# EAGLE board esp32-nbiot-xx-v12-wroom32 (EAGLE 7.3.0), part 1 of 2
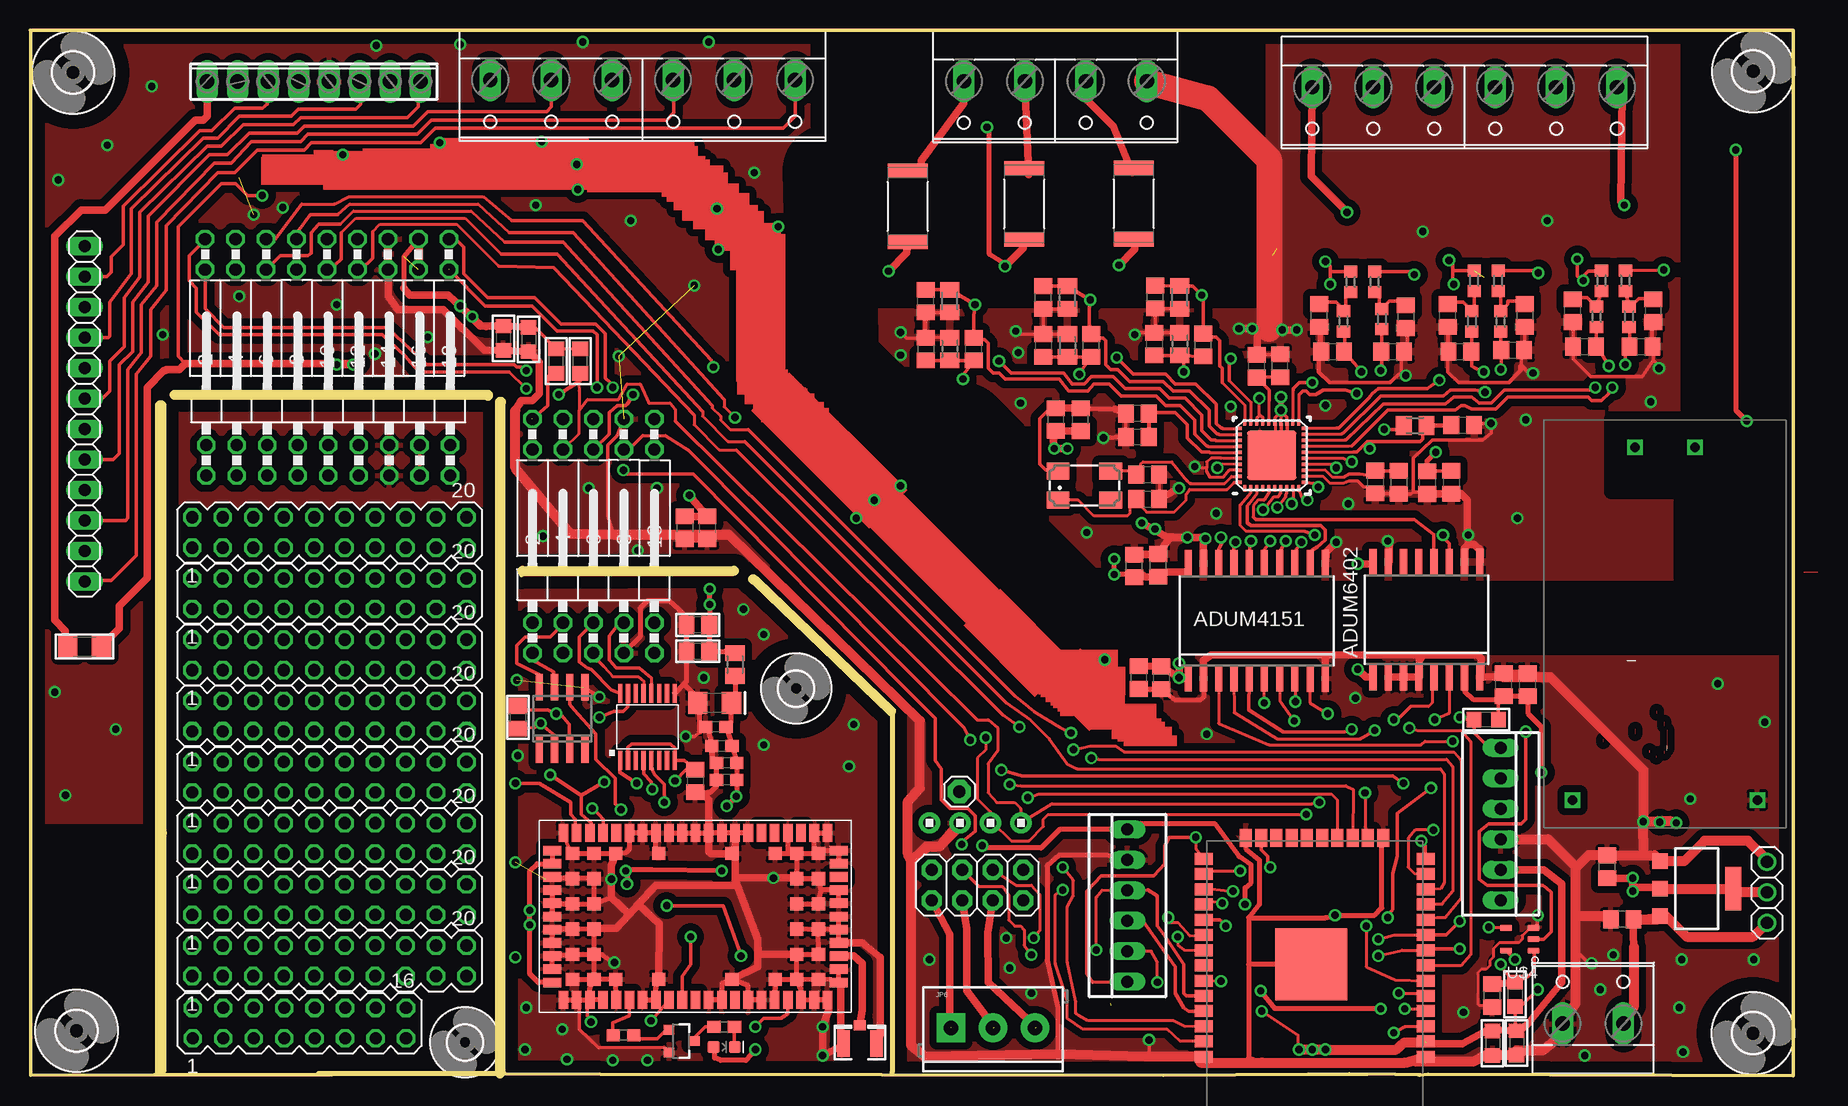
[diagram p3: board, top side]
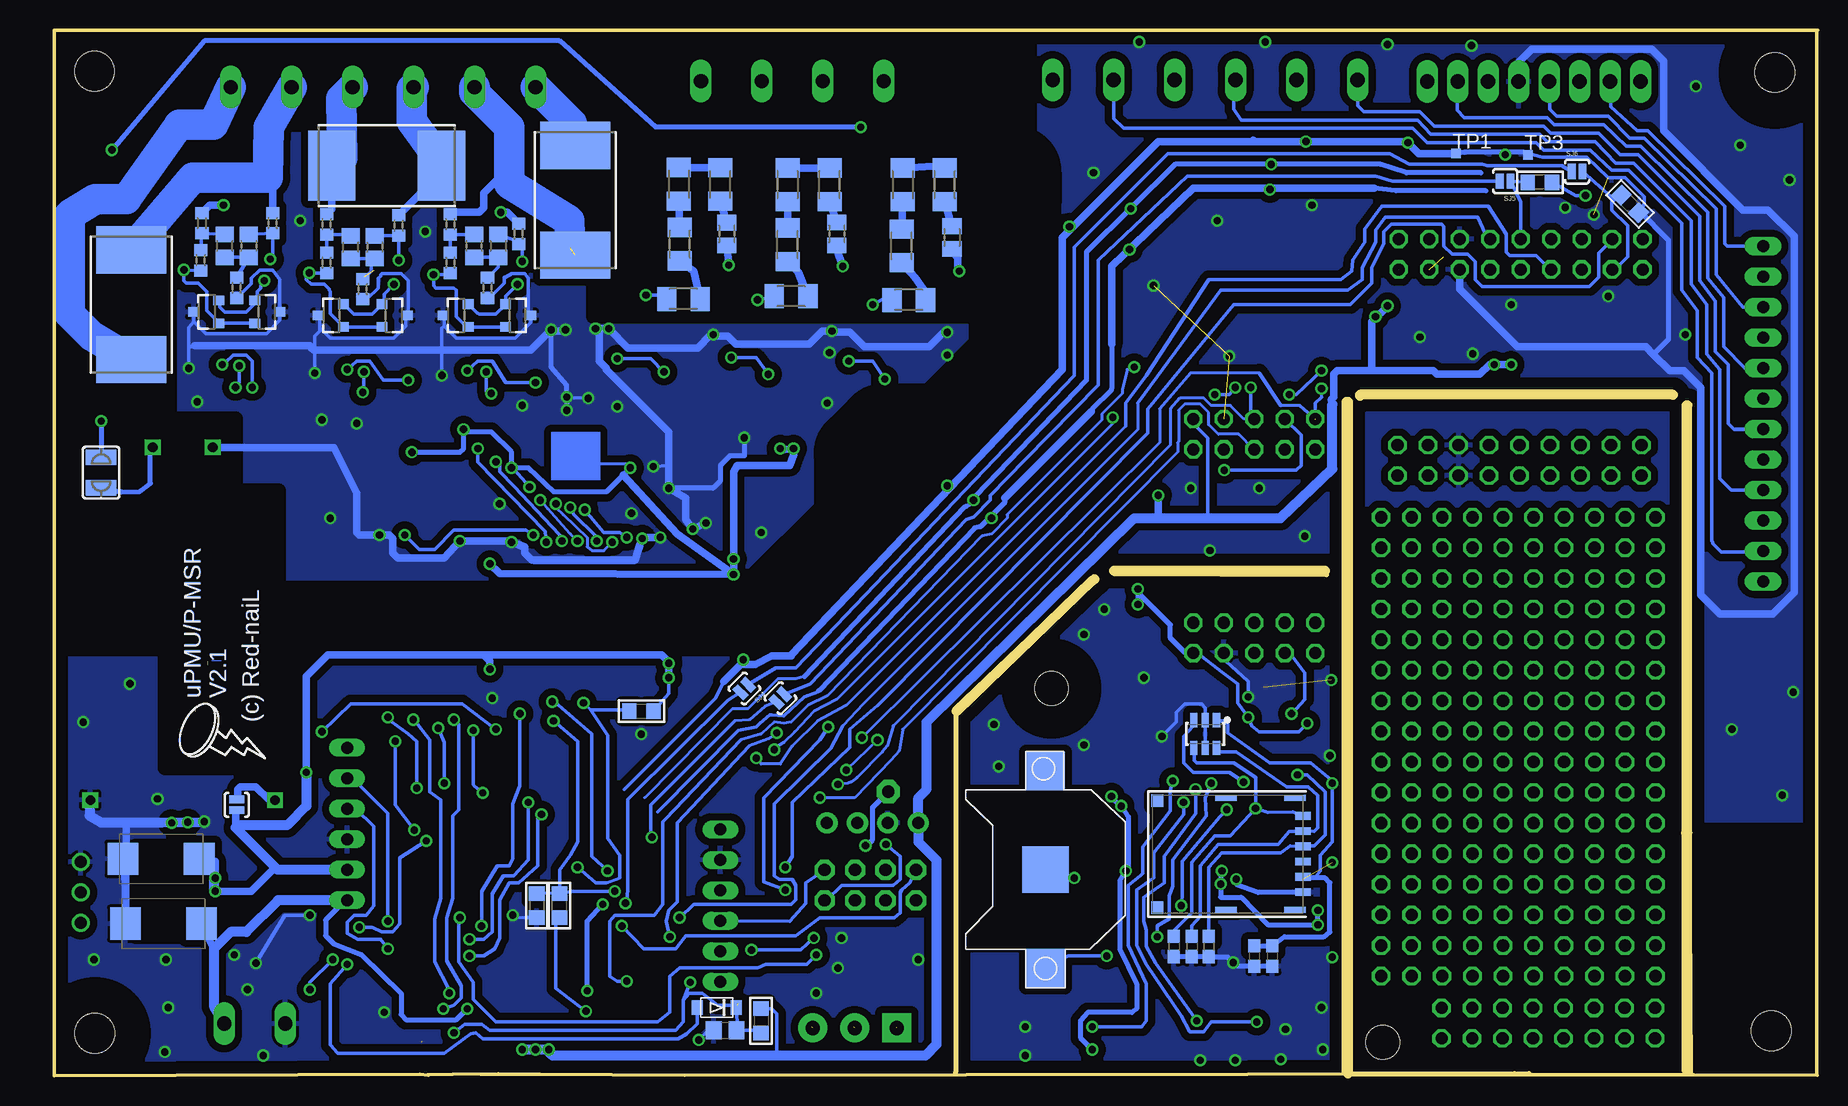
[diagram p4: board, bottom side, seen from below]

Size 146.95 x 87.2 mm. Coordinates in mm from the lower left corner, seen from the top.
Outline: 0.05,0.07 10.45,0.1
Outline: 10.45,0.1 10.35,0.1
Outline: 10.45,0.1 10.55,0.1
Outline: 10.55,0.1 10.65,20.3
Outline: 10.65,20.3 11.25,20.3 11.25,20.2
Outline: 111.42,0.12 109.9,0.12 106.5,0.15 94.42,0.07 24.05,0.2 25.25,0.2
Outline: 109.95,0.17 113.75,0.15 115.7,0.1 115.85,0.1 115.8,0.05 116.5,0.15 146.95,0 146.95,87.17 0,87.17 0.07,87.2 0.07,0.1
Outline: 12.05,56.9 12.05,56.8
Outline: 12.05,56.8 12.05,56.7
Outline: 12.05,56.7 38.15,56.7 38.15,56.8 12.05,56.8
Outline: 39.05,56.1 39.05,0.2 25.25,0.2
Outline: 71.55,30.4 60.25,41.4 60.45,41.3 71.75,30.4
Outline: 39.45,0.3 39.45,56.1
Outline: 10.65,0.4 10.65,20.3
Outline: 10.65,20.3 10.65,56
Outline: 12.05,57 37.45,57
Outline: 37.45,57 38.15,57
Outline: 12.05,56.7 37.45,57
Outline: 60.35,41.6 71.95,30.5
Outline: 71.85,30.3 71.85,0.3
Outline: 58.65,41.9 40.95,41.8
Outline: 40.95,42.3 58.45,42.3 58.65,42.2
Outline: 39.25,56.2 39.15,56.2 39.15,0.2
Outline: 10.85,55.9 10.95,55.9 10.95,0.5
Outline: 41.05,42.1 58.65,42.1
Outline: 10.55,0.1 25.15,0.1 25.25,0.2
Copper layers (1*16): Top 0.035mm / dielectric 1.5mm / Bottom 0.035mm
Design rules "default *": minimum track width 5mil, minimum drill 24mil, track to track 5mil, track to pad 8mil, pad to pad 8mil, via to via 8mil, smd to smd 8mil, copper to edge 40mil, drill to drill 8mil, minimum pad ring 10mil, minimum via ring 8mil, stop-mask expansion 4mil, vias tented up to drill 0mil, thermal gap 10mil
tKeepout: area 89.2,35.7 to 144.5,40.3; area 143.4,35.7 to 146.9,40.2; area 65.7,77.1 to 70.5,87.1; area 69.2,78.4 to 72.4,87.3; area 68.5,76.5 to 70.5,78.6; 10 lines
bKeepout: area 89.4,35.8 to 146.9,40.3; area 65.7,77.2 to 70.4,87.1; area 68.7,76.3 to 70.4,78.6; area 69.2,78.2 to 72.4,87.3; area 128.4,25.8 to 137.6,48.8; 8 lines
tRestrict: area 87.7,35.7 to 146.8,40.7; area 137.6,40 to 146.4,49.2; area 138.1,54.1 to 146.8,87; area 69.7,64.6 to 102.4,87.4; area 65.7,77.2 to 70.4,87; area 68.5,76.4 to 70.5,78.7; area 69.2,78.5 to 72.2,87.2; area 131.8,48.7 to 146.9,54.8; area 0.3,0.3 to 10.6,20.4; area 99,-0.8 to 115.2,19; 11 lines
bRestrict: area 128.2,25.7 to 137.8,48.8; area 88.3,35.6 to 146.6,40.7; area 138.8,35.8 to 146.9,40.6; area 137.5,40 to 147,49.2; area 96.2,79.3 to 146.8,87.4; area 135.3,74.4 to 146.8,87; area 69.7,63.3 to 102,87.3; area 65.7,77.3 to 70.4,87.2; area 68.5,76.4 to 70.5,78.7; area 69.2,78.3 to 72.2,87; area 131.9,48 to 147.1,54.8; area 138.1,54.7 to 146.6,75.8; area 137.3,54.7 to 146.8,75.6; area 0.1,0 to 10.3,20.5; area 58.9,10.9 to 71,23.7; area 43.1,13.7 to 55.1,23.2; area 135.9,11.6 to 140.1,19.2; 6 lines

## Footprints (pad centres in the part's own frame; a part is rotated, then mirrored left to right if it is on the bottom)
R4527 = smd 3.94 x 5.84: 1 -4.575,0; 2 4.575,0
LFCSP40 = smd 0.55 x 0.3: 1 -2.75,2.25; 2 -2.75,1.75; 3 -2.75,1.25; 4 -2.75,0.75; 5 -2.75,0.25; 6 -2.75,-0.25; 7 -2.75,-0.75; 8 -2.75,-1.25; 9 -2.75,-1.75; 10 -2.75,-2.25; 21 2.75,-2.25; 22 2.75,-1.75; 23 2.75,-1.25; 24 2.75,-0.75; 25 2.75,-0.25; 26 2.75,0.25; 27 2.75,0.75; 28 2.75,1.25; 29 2.75,1.75; 30 2.75,2.25 | smd 0.3 x 0.55: 11 -2.25,-2.75; 12 -1.75,-2.75; 13 -1.25,-2.75; 14 -0.75,-2.75; 15 -0.25,-2.75; 16 0.25,-2.75; 17 0.75,-2.75; 18 1.25,-2.75; 19 1.75,-2.75; 20 2.25,-2.75; 31 2.25,2.75; 32 1.75,2.75; 33 1.25,2.75; 34 0.75,2.75; 35 0.25,2.75; 36 -0.25,2.75; 37 -0.75,2.75; 38 -1.25,2.75; 39 -1.75,2.75; 40 -2.25,2.75 | smd 4.1 x 4.1: GND 0,0
SOIC20R = smd 0.6 x 2.2: 1 -5.715,-4.775; 2 -4.445,-4.775; 3 -3.175,-4.775; 4 -1.905,-4.775; 5 -0.635,-4.775; 6 0.635,-4.775; 7 1.905,-4.775; 8 3.175,-4.775; 9 4.445,-4.8; 10 5.715,-4.8; 11 5.715,4.8; 12 4.445,4.8; 13 3.175,4.8; 14 1.905,4.8; 15 0.635,4.8; 16 -0.635,4.8; 17 -1.905,4.8; 18 -3.175,4.8; 19 -4.445,4.8; 20 -5.715,4.8
SOIC16R = smd 0.6 x 2.2: 1 -4.445,-4.775; 2 -3.175,-4.775; 3 -1.905,-4.775; 4 -0.635,-4.775; 5 0.635,-4.775; 6 1.905,-4.775; 7 3.175,-4.775; 8 4.445,-4.775; 9 4.445,4.8; 10 3.175,4.8; 11 1.905,4.8; 12 0.635,4.8; 13 -0.635,4.8; 14 -1.905,4.8; 15 -3.175,4.8; 16 -4.445,4.8
C0805 = smd 1.3 x 1.5: 1 -0.95,0; 2 0.95,0
_0805 = smd 1.2 x 1.3: 1 -1.016,0; 2 1.016,0
0805 = smd 1.3 x 1.5: 1 -0.95,0; 2 0.95,0
0603 = smd 1.1 x 1: 1 -0.85,0; 2 0.85,0
1206-POLAR = smd 1.6 x 1.8: 1 -1.4,0; 2 1.4,0
D/7343-31R = smd 2.55 x 2.7: + 3.175,0; - -3.175,0
SOD-123FL = smd 0.91 x 1.22: A 1.637,0; C -1.637,0
LED-0603 = smd 1 x 1: A -0.877,0; C 0.877,0
SOT23-6L = smd 0.6 x 1.2: 1 -0.95,-1.15; 2 0,-1.15; 3 0.95,-1.15; 4 0.95,1.15; 5 0,1.15; 6 -0.95,1.15
RESC6332X71N = smd 1.194 x 3.353: 1 -2.972,0; 2 2.972,0
3,3 = hole 3.3: 0,0
1X4 = drill 1.016 pad 1.778: 1 0,0; 2 2.54,0; 3 5.08,0; 4 7.62,0
HKLPM01 = drill 0.8 square: P$1 -14.7,2.5; P$2 -14.7,-2.5; P$3 14.7,7.7; P$4 14.7,-7.7
NANO_SIM_WURTH_693043020611 = smd 0.65 x 1.3: C1 1.905,6.25; C2 -0.635,6.25; C3 -1.905,6.25; C5 3.175,6.25; C6 0.635,6.25; C7 -3.175,6.25 | smd 0.48 x 1.8: MNT1 -4.69,5.58; MNT2 4.66,5.58; MNT3 -4.69,-0.17; MNT4 4.66,-0.17 | smd 1.03 x 1: MNT5 -4.465,-5.89; MNT6 4.465,-5.89
2X04 = drill 1.016 pad 1.676 octagon: 1 -3.81,-1.27; 2 -3.81,1.27; 3 -1.27,-1.27; 4 -1.27,1.27; 5 1.27,-1.27; 6 1.27,1.27; 7 3.81,-1.27; 8 3.81,1.27
2X05/90 = drill 1.016 octagon: 1 -5.08,-6.35; 2 -5.08,-3.81; 3 -2.54,-6.35; 4 -2.54,-3.81; 5 0,-6.35; 6 0,-3.81; 7 2.54,-6.35; 8 2.54,-3.81; 9 5.08,-6.35; 10 5.08,-3.81
2X09/90 = drill 1.016 octagon: 1 -10.16,-6.35; 2 -10.16,-3.81; 3 -7.62,-6.35; 4 -7.62,-3.81; 5 -5.08,-6.35; 6 -5.08,-3.81; 7 -2.54,-6.35; 8 -2.54,-3.81; 9 0,-6.35; 10 0,-3.81; 11 2.54,-6.35; 12 2.54,-3.81; 13 5.08,-6.35; 14 5.08,-3.81; 15 7.62,-6.35; 16 7.62,-3.81; 17 10.16,-6.35; 18 10.16,-3.81
1X12 = drill 1.016 long: 1 -13.97,0; 2 -11.43,0; 3 -8.89,0; 4 -6.35,0; 5 -3.81,0; 6 -1.27,0; 7 1.27,0; 8 3.81,0; 9 6.35,0; 10 8.89,0; 11 11.43,0; 12 13.97,0
1X03 = drill 1.016: 1 -2.54,0; 2 0,0; 3 2.54,0
SCREWTERMINAL-3.5MM-3 = drill 1.2 pad 2.413 square: 1 0,0 | drill 1.2 pad 2.413: 2 3.5,0; 3 7,0
1X01 = drill 1.016 pad 1.93 octagon: 1 0,0
M0805 = smd 1.3 x 1.6: 1 -0.95,0; 2 0.95,0
1206 = smd 1.6 x 1.8: 1 -1.4,0; 2 1.4,0
CTS406 = smd 1.9 x 1.4: 1 -2.2,-1.2; 2 2.2,-1.2; 3 2.2,1.2; 4 -2.2,1.2
SOT23-3 = smd 0.8 x 0.9: 1 -0.95,-1; 2 0.95,-1; 3 0,1.1
M1206 = smd 1.6 x 2: 1 -1.4,0; 2 1.4,0
R0805 = smd 1.3 x 1.5: 1 -0.95,0; 2 0.95,0
R0603 = smd 1 x 1.1: 1 -0.85,0; 2 0.85,0
SJ_2S-NO = smd 0.635 x 1.27: 1 -0.45,0; 2 0.45,0
SOLDERJUMPER_WAVE = smd 1.27 x 2.54: 1 -1.27,0; 2 1.27,0
FE05-2W = drill 1.016 octagon: 1 -5.08,1.27; 2 -5.08,-1.27; 3 -2.54,1.27; 4 -2.54,-1.27; 5 0,1.27; 6 0,-1.27; 7 2.54,1.27; 8 2.54,-1.27; 9 5.08,1.27; 10 5.08,-1.27
FE09-2W = drill 1.016 octagon: 1 -10.16,1.27; 2 -10.16,-1.27; 3 -7.62,1.27; 4 -7.62,-1.27; 5 -5.08,1.27; 6 -5.08,-1.27; 7 -2.54,1.27; 8 -2.54,-1.27; 9 0,1.27; 10 0,-1.27; 11 2.54,1.27; 12 2.54,-1.27; 13 5.08,1.27; 14 5.08,-1.27; 15 7.62,1.27; 16 7.62,-1.27; 17 10.16,1.27; 18 10.16,-1.27
MA10-2 = drill 1.016 octagon: 1 -11.43,-1.27; 2 -11.43,1.27; 3 -8.89,-1.27; 4 -8.89,1.27; 5 -6.35,-1.27; 6 -6.35,1.27; 7 -3.81,-1.27; 8 -3.81,1.27; 9 -1.27,-1.27; 10 -1.27,1.27; 11 1.27,-1.27; 12 1.27,1.27; 13 3.81,-1.27; 14 3.81,1.27; 15 6.35,-1.27; 16 6.35,1.27; 17 8.89,-1.27; 18 8.89,1.27; 19 11.43,-1.27; 20 11.43,1.27
MA08-2 = drill 1.016 octagon: 1 -8.89,-1.27; 2 -8.89,1.27; 3 -6.35,-1.27; 4 -6.35,1.27; 5 -3.81,-1.27; 6 -3.81,1.27; 7 -1.27,-1.27; 8 -1.27,1.27; 9 1.27,-1.27; 10 1.27,1.27; 11 3.81,-1.27; 12 3.81,1.27; 13 6.35,-1.27; 14 6.35,1.27; 15 8.89,-1.27; 16 8.89,1.27
TP08SQ = smd 0.8 x 0.8: TP 0,0
TSSOP16 = smd 1.6 x 0.35: P$1 -2.8,2.275; P$2 -2.8,1.625; P$3 -2.8,0.975; P$4 -2.8,0.325; P$5 -2.8,-0.325; P$6 -2.8,-0.975; P$7 -2.8,-1.625; P$8 -2.8,-2.275; P$9 2.8,-2.275; P$10 2.8,-1.625; P$11 2.8,-0.975; P$12 2.8,-0.325; P$13 2.8,0.325; P$14 2.8,0.975; P$15 2.8,1.625; P$16 2.8,2.275
SOT223-R = smd 1.3 x 1.3: 1 -2.3,-3.05; 2 0,-3.05; 3 2.3,-3.05 | smd 3.6 x 1.3: 4 0,3.05
ESP-WROOM-32 = smd 1.5 x 1: 1 -9.25,7; 2 -9.25,5.73; 3 -9.25,4.46; 4 -9.25,3.19; 5 -9.25,1.92; 6 -9.25,0.65; 7 -9.25,-0.62; 8 -9.25,-1.89; 9 -9.25,-3.16; 10 -9.25,-4.43; 11 -9.25,-5.7; 12 -9.25,-6.97; 13 -9.25,-8.24; 14 -9.25,-9.51; 25 9.25,-9.51; 26 9.25,-8.24; 27 9.25,-6.97; 28 9.25,-5.7; 29 9.25,-4.43; 30 9.25,-3.16; 31 9.25,-1.89; 32 9.25,-0.62; 33 9.25,0.65; 34 9.25,1.92; 35 9.25,3.19; 36 9.25,4.46; 37 9.25,5.73; 38 9.25,7 | smd 1 x 1.5: 15 -5.7,-11.25; 16 -4.43,-11.25; 17 -3.16,-11.25; 18 -1.89,-11.25; 19 -0.62,-11.25; 20 0.65,-11.25; 21 1.92,-11.25; 22 3.19,-11.25; 23 4.46,-11.25; 24 5.73,-11.25 | smd 6 x 6: GND 0.3,-0.7
SOIC8 = smd 0.6 x 2.2: 32KHZ -1.905,-2.6; !INT/!!SQW 0.635,-2.6; !RST 1.905,-2.6; GND 1.905,2.6; SCL -1.905,2.6; SDA -0.635,2.6; VBAT 0.635,2.6; VCC -0.635,-2.6
CR1220-SMD = smd 3.2 x 3.2: +$1 -8.2,0; +$2 8.2,0 | smd 3.9 x 3.9: - 0,0
SOT-23-5L = smd 0.5 x 1: 1 -0.95,-1.15; 2 0,-1.15; 3 0.95,-1.15; 4 0.95,1.15; 5 -0.95,1.15
SARA-N2 = smd 1.5 x 0.8: P$1 1.05,2; P$2 1.05,3.1; P$3 1.05,4.2; P$4 1.05,5.3; P$5 1.05,6.4; P$6 1.05,7.5; P$7 1.05,8.6; P$8 1.05,9.7; P$9 1.05,10.8; P$10 1.05,11.9; P$11 1.05,13; P$12 1.05,14.1; P$13 1.05,15.2; P$14 1.05,16.3; P$15 1.05,17.4; P$16 1.05,18.5; P$17 1.05,19.6; P$18 1.05,20.7; P$19 1.05,21.8; P$20 1.05,22.9; P$21 1.05,24; P$22 14.95,2; P$23 14.95,3.1; P$24 14.95,4.2; P$25 14.95,5.3; P$26 14.95,6.4; P$27 14.95,7.5; P$28 14.95,8.6; P$29 14.95,9.7; P$30 14.95,10.8; P$31 14.95,11.9; P$32 14.95,13; P$33 14.95,14.1; P$34 14.95,15.2; P$35 14.95,16.3; P$36 14.95,17.4; P$37 14.95,18.5; P$38 14.95,19.6; P$39 14.95,20.7; P$40 14.95,21.8; P$41 14.95,22.9; P$42 14.95,24 | smd 0.8 x 1.5: P$43 3.6,24.95; P$44 4.7,24.95; P$45 5.8,24.95; P$46 6.9,24.95; P$47 8,24.95; P$48 9.1,24.95; P$49 10.2,24.95; P$50 11.3,24.95; P$51 12.4,24.95; P$52 13.5,24.95; P$53 2.5,24.95; P$54 2.5,1.05; P$55 3.6,1.05; P$56 4.7,1.05; P$57 5.8,1.05; P$58 6.9,1.05; P$59 8,1.05; P$60 9.1,1.05; P$61 10.2,1.05; P$62 11.3,1.05; P$63 12.4,1.05; P$64 13.5,1.05 | smd 1.1 x 1.1: P$65 2.75,23.25; P$66 4.85,23.25; P$67 6.95,23.25; P$68 9.05,23.25; P$69 11.15,23.25; P$70 13.25,23.25; P$71 2.75,21.45; P$72 4.85,21.45; P$73 6.95,21.45; P$74 9.05,21.45; P$75 11.15,21.45; P$76 13.25,21.45; P$77 2.75,19.65; P$78 13.25,19.65; P$79 2.75,16.05; P$80 13.25,16.05; P$81 13.25,2.75; P$82 11.15,2.75; P$83 9.05,2.75; P$84 6.95,2.75; P$85 4.85,2.75; P$86 2.75,2.75; P$87 13.25,4.55; P$88 11.15,4.55; P$89 9.05,4.55; P$90 6.95,4.55; P$91 4.85,4.55; P$92 2.75,4.55; P$93 13.25,6.35; P$94 2.75,6.35; P$95 13.25,9.95; P$96 2.75,9.95
2,8 = hole 2.8: 0,0
22-23-2061 = drill 1 long: 1 -6.35,0; 2 -3.81,0; 3 -1.27,0; 4 1.27,0; 5 3.81,0; 6 6.35,0
W237-4P = drill 1.194 long: 1 -7.62,-0.635; 2 -2.54,-0.635; 3 2.54,-0.635; 4 7.62,-0.635
W237-6P = drill 1.194 long: 1 -12.7,-0.635; 2 -7.62,-0.635; 3 -2.54,-0.635; 4 2.54,-0.635; 5 7.62,-0.635; 6 12.7,-0.635
U.FL = smd 2.2 x 1.05: 1 0,1.375; 2 0,-1.375 | smd 0.8 x 1: 3 1.525,0
W237-132 = drill 1.194 long: 1 -2.54,-0.635; 2 2.54,-0.635
8POL254 = drill 1.2 long: 1 -8.89,0; 2 -6.35,0; 3 -3.81,0; 4 -1.27,0; 5 1.27,0; 6 3.81,0; 7 6.35,0; 8 8.89,0

## Placement (x,y rotation side)
0.05/2W  [R4527]  103.55,73 270 bottom
0.05/2W1  [R4527]  140.55,64.3 270 bottom
0.05/2W2  [R4527]  119.25,75.9 180 bottom
ADE9000  [LFCSP40]  103.48,51.74 180 top
ADUM4151  [SOIC20R]  102.23,37.93 0 top
ADUM6402-2  ADUM6402  [SOIC16R]  116.36,38.03 0 top
C1  1uF  [C0805]  119.39,54.26 0 top
C2  0.1uF  [C0805]  114.06,49.5 270 top
C3  4.7uF  [C0805]  112.11,49.53 270 top
C4  0.1uF  [C0805]  104.17,59.2 90 top
C5  4.7uF  [C0805]  102.22,59.17 90 top
C6  0.1uF  [C0805]  92.28,55.22 180 top
C7  4.7uF  [C0805]  92.28,53.25 180 top
C8  18pF  [C0805]  93.14,48.11 0 top
C9  18pF  [C0805]  93.14,50.13 0 top
C10  0.1uF  [C0805]  85.5,54.73 90 top
C11  10uF  [C0805]  87.55,54.72 90 top
C12  22nF  [C0805]  84.45,60.9 270 top
C13  22nF  [C0805]  84.45,64.9 90 top
C14  51pF  [C0805]  88.45,60.9 90 top
C15  22nF  [C0805]  74.65,60.6 270 top
C16  22nF  [C0805]  74.65,64.6 90 top
C17  51pF  [C0805]  78.65,60.6 90 top
C18  22nF  [C0805]  129.55,60.8 0 top
C18E  100nF  [_0805]  121.89,2.71 270 top
C18E1  100nF  [_0805]  39.45,61.5 270 top
C19  22nF  [C0805]  134.25,60.8 0 top
C19E  10U  [_0805]  123.89,2.74 270 top
C19E1  10U  [_0805]  41.55,61.4 270 top
C20  22nF  [C0805]  119.15,60.4 0 top
C21  22nF  [C0805]  123.55,60.5 0 top
C22  22nF  [C0805]  108.55,60.4 0 top
C23  22nF  [C0805]  113.55,60.4 0 top
C24  [0805]  55.65,37.6 180 top
C25  [0805]  55.65,35.4 180 top
C26  47pF  [0603]  50.75,10.8 270 bottom
C27  47pF  [0603]  52.15,10.8 270 bottom
C28  47pF  [0603]  53.65,10.8 270 bottom
C29  47pF  [0603]  46.95,10 270 bottom
C30  0.1uF  [0603]  45.45,10 270 bottom
C30A  0.1uF  [C0805]  92.38,33.21 270 top
C30A1  68pfF  [C0805]  54.55,45.7 270 top
C31  100uF  [1206-POLAR]  57.05,31.1 180 top
C31A  10uF  [C0805]  94.28,33.19 270 top
C31A1  10pF  [C0805]  56.45,45.7 270 top
C32  0.1uF  [0603]  57.15,29.1 180 top
C32A  0.1uF  [C0805]  94.02,42.56 90 top
C33  10nF  [0603]  57.65,27.5 180 top
C33A  10uF  [C0805]  92.02,42.51 90 top
C34  15pF  [0603]  58.05,24.7 180 top
C34A  10uF  [C0805]  116.43,49.47 270 top
C35  68pF  [0603]  58.05,26.1 180 top
C35A  0.1uF  [C0805]  118.43,49.48 270 top
C36  [D/7343-31R]  137.85,12.7 0 bottom
C36A  0.1uF  [C0805]  124.82,32.61 90 top
C37  [D/7343-31R]  138.05,18.1 0 bottom
C37A  10uF  [C0805]  122.82,32.61 90 top
C40U1  10uF  [C0805]  121.85,6.7 90 top
C40U2  100n  [C0805]  91.05,3.8 0 bottom
C40U3  0.1uF  [C0805]  55.45,24.6 270 top
C44P  10uF  [C0805]  132.69,13.04 180 top
C45P  10uF  [C0805]  131.44,17.44 90 top
C100  22nF  [C0805]  93.77,64.94 90 top
C101  51pF  [C0805]  97.77,60.94 90 top
C200  22nF  [C0805]  93.68,61.01 270 top
D1  [SOD-123FL]  91.75,5.7 180 bottom
D5  BLUE  [LED-0603]  57.85,2.4 0 top
D6  DT1042-04SO-7  [SOT23-6L]  51.05,28.5 180 bottom
FUSE1  [RESC6332X71N]  82.85,72.7 90 top
FUSE2  [RESC6332X71N]  91.97,72.73 90 top
FUSE3  [RESC6332X71N]  73.15,72.5 90 top
H1  MOUNT-HOLE3.3  [3,3]  3.87,3.76 0 top
H2  MOUNT-HOLE3.3  [3,3]  143.58,3.56 0 top
H3  MOUNT-HOLE3.3  [3,3]  3.59,83.66 0 top
H4  MOUNT-HOLE3.3  [3,3]  143.6,83.76 0 top
H5  1X4  [1X4]  74.95,21.1 0 top
HKLP1  HKLPM01  [HKLPM01]  136.25,37.7 270 top
J9  NANO_SIM  [NANO_SIM_WURTH_693043020611]  49.15,18.5 270 bottom
JP1  [2X04]  78.95,15.9 180 top
JP2  [2X05/90]  46.95,41.6 0 top
JP3  [2X09/90]  24.85,56.4 0 top
JP4  [1X12]  4.55,55.2 90 top
JP5  [1X03]  144.75,15.3 90 top
JP6  [SCREWTERMINAL-3.5MM-3]  76.75,4 0 top
JP8  [1X01]  77.45,23.7 0 top
L1  1500  [M0805]  90.92,70.19 90 bottom
L2  1500  [M0805]  81.75,70.2 90 bottom
L3  1500  [M0805]  72.15,69.9 90 bottom
L4  1500  [M0805]  58.75,34.3 90 top
PTC1  [1206]  4.55,35.8 0 top
Q1  [CTS406]  87.86,49.22 0 top
Q2  MMBD4148SE  [SOT23-3]  129.25,63.7 270 bottom
Q3  MMBD4148SE  [SOT23-3]  134.25,63.7 90 bottom
Q4  MMBD4148SE  [SOT23-3]  118.65,63.4 270 bottom
Q5  MMBD4148SE  [SOT23-3]  123.85,63.4 90 bottom
Q6  MMBD4148SE  [SOT23-3]  108.35,63.4 270 bottom
Q7  MMBD4148SE  [SOT23-3]  113.45,63.4 90 bottom
Q8  600mA/40V  [SOT23-3]  54.25,2.9 270 top
R1  200k  [M1206]  94.91,74.34 90 bottom
R2  1k  [M0805]  86.45,60.9 90 top
R3  10k  [M0805]  115.42,54.22 180 top
R4  0/200k  [M1206]  94.82,69.35 270 bottom
R5  1k  [M0805]  86.45,64.9 270 top
R6  200k  [M1206]  82.35,74.3 270 bottom
R7  0/200K  [M1206]  85.55,65 0 bottom
R8  200k  [M1206]  85.85,74.3 90 bottom
R9  0/200k  [M1206]  85.85,69.3 270 bottom
R10  1k  [M0805]  76.65,60.6 90 top
R11  1k  [M0805]  76.65,64.6 270 top
R12  200k  [M1206]  72.75,74.3 270 bottom
R13  0/200K  [M1206]  75.75,64.7 0 bottom
R14  200k  [M1206]  76.25,74.3 90 bottom
R15  0/200k  [M1206]  76.35,69.2 270 bottom
R15E1  10k/nc  [_0805]  104.85,14.2 90 bottom
R15E2  10k/nc  [_0805]  106.75,14.2 270 bottom
R15E3  4k7  [_0805]  45.85,59.6 90 top
R15E4  10k  [_0805]  88.05,4.6 270 bottom
R15E6  4k7  [_0805]  43.85,59.6 90 top
R15E7  ]  [_0805]  121.35,29.7 180 top
R15E8  +  [_0805]  123.75,6.8 270 top
R15E10  4k7  [_0805]  15.65,72.7 315 bottom
R15E11  4k7  [_0805]  23.15,74.5 180 bottom
R16  5.1  [R0805]  130.75,69.2 270 bottom
R17  5.1  [R0805]  132.75,69.2 90 bottom
R18  [0805]  40.65,29.9 270 top
R19  10k  [0603]  49.45,3.4 180 top
R20  0  [R0603]  131.75,65.7 270 bottom
R20E  10K  [_0805]  98.02,30.42 0 bottom
R21  0  [R0603]  130.95,66.3 270 top
R22  0  [R0603]  132.95,66.3 90 top
R23  0  [R0603]  128.75,71.1 270 bottom
R24  0  [R0603]  134.65,71.1 270 bottom
R25  0  [R0603]  134.75,68 270 bottom
R26  5.1  [R0805]  120.25,69.1 270 bottom
R27  5.1  [R0805]  122.25,69.1 90 bottom
R28  0  [R0603]  120.35,66.3 270 top
R29  0  [R0603]  122.35,66.3 90 top
R30  1k  [R0603]  120.15,62.9 270 top
R31  1k  [R0603]  122.55,62.9 270 top
R32  1k  [0603]  57.85,4.1 0 top
R34  0  [R0603]  121.25,65.6 270 bottom
R35  1k  [R0603]  130.55,63.3 270 top
R36  1k  [R0603]  133.25,63.3 270 top
R37  0  [R0603]  118.25,70.9 270 bottom
R38  0  [R0603]  124.25,71 270 bottom
R39  0  [R0603]  124.25,67.8 270 bottom
R40  5.1  [R0805]  109.95,69.2 270 bottom
R41  5.1  [R0805]  111.95,69.2 90 bottom
R42  0  [R0603]  110.05,66.2 270 top
R43  0  [R0603]  112.05,66.2 90 top
R44  1k  [R0603]  109.45,62.9 270 top
R45  1k  [R0603]  112.65,63.1 270 top
R48  0  [R0603]  110.85,65.7 270 bottom
R49  0  [R0603]  108.25,70.2 270 bottom
R50  0  [R0603]  113.95,71 270 bottom
R51  0  [R0603]  113.95,67.8 270 bottom
R100  0/200K  [M1206]  94.52,64.78 0 bottom
R101  200k  [M1206]  91.47,74.33 270 bottom
R104  1k  [M0805]  95.81,64.91 270 top
R200  1k  [M0805]  95.82,61.02 90 top
SJ1  SOLDERJUMPERNO  [SJ_2S-NO]  131.75,22.6 90 bottom
SJ2  [SOLDERJUMPER_WAVE]  143.05,50.3 270 bottom
SJ3  SOLDERJUMPERNO  [SJ_2S-NO]  86.45,31.5 225 bottom
SJ4  SOLDERJUMPERNO  [SJ_2S-NO]  89.45,32.3 225 bottom
SJ5  SOLDERJUMPERNO  [SJ_2S-NO]  26.05,74.6 180 bottom
SJ6  SOLDERJUMPERNO  [SJ_2S-NO]  20.05,75.4 0 bottom
SP1  NC  [C0805]  128.55,63.8 90 top
SP2  NC  [C0805]  118.15,63.4 90 top
SP3  NC  [C0805]  107.45,63.4 90 top
SP@  NC  [C0805]  135.25,63.8 270 top
SP@1  NC  [C0805]  124.55,63.4 270 top
SP@2  NC  [C0805]  114.65,63.3 270 top
SV1  [FE05-2W]  46.95,53.5 0 top
SV2  [FE09-2W]  24.75,68.5 0 top
SV3  [MA10-2]  24.95,45.3 0 top
SV4  [MA10-2]  24.95,40.2 0 top
SV5  [MA10-2]  24.95,35.1 0 top
SV6  [MA10-2]  24.95,30 0 top
SV7  [MA08-2]  22.45,4.4 0 top
SV8  [MA10-2]  24.95,24.9 0 top
SV9  [MA10-2]  24.95,19.8 0 top
SV10  [MA10-2]  24.95,14.7 0 top
SV11  [MA10-2]  24.95,9.6 0 top
TP1  PTR1TP08SQ  [TP08SQ]  30.15,76.9 0 bottom
TP3  PTR1TP08SQ  [TP08SQ]  24.15,76.8 0 bottom
U1  TXB0106  [TSSOP16]  51.45,29.1 90 top
U3  [SOT223-R]  138.89,15.61 270 top
U4  ESP-WROOM-32  [ESP-WROOM-32]  107.05,8.6 180 top
U$1  DS3232M  [SOIC8]  44.35,29.8 0 top
U$3  [CR1220-SMD]  64.35,17.2 90 bottom
U$4  SN74LVC1G126DBVT  [SOT-23-5L]  124.15,11.4 90 top
U$5  U-BLOX_SARA-N2  [SARA-N2]  68.45,5.3 90 top
U$7  [2,8]  36.25,2.8 0 top
U$8  [2,8]  63.85,32.3 0 top
X1  [22-23-2061]  122.55,21 270 top
X2  [W237-4P]  85.45,82.3 180 top
X3  [W237-6P]  119.55,81.8 180 top
X4  [U.FL]  69.15,2.7 90 top
X5  [22-23-2061]  91.45,14.2 90 top
X6  [W237-132]  130.25,5 0 top
X7  [8POL254]  23.65,82.9 0 top
X8  [W237-6P]  51.05,82.4 180 top

## Tracks (layer width: path | path; a pad name or v marks a point on that pad's centre or on a via)
1V8  (via drill 0.6)
  Top 0.305: U1.P$2 49.83,27.37 50.15,27.7 53.35,27.7 53.75,27.3 53.75,26.32 U1.P$8 54.5,26.3 C40U3.1 54.7,25.55 v53.75,24.6 | v60.45,4.1 61.15,4.8 62.55,4.8 63.15,5.2 U$5.P$4
  Bottom 0.305: v53.75,24.6 53.95,23.8 53.95,22.1 56.25,19.1 56.25,16.9 56.45,16.7 57.45,15.9 57.45,10.9 55.95,7.7 55.95,4.6 56.35,4.1 v60.45,4.1
1WIRE
  Bottom 0.305: JP4.12 7.42,69.17 7.45,69.2 7.55,69.2 7.75,69.4 7.75,72.5 14.15,78.8 15.05,78.8 17.25,80.8 17.25,82.85 X7.2
+3V3  (via drill 0.6)  (2 unrouted)
  Top 0.254: R15E3.2 45.93,60.6 R15E6.2 | 111.85,32.8 111.85,33.19 ADUM6402-2.1 | 110.84,33.41 v110.65,33.9 | v102.65,5.4 105.65,3.4 105.65,2.2 106.55,2.5 v106.85,2.2
  Top 0.305: C19E.1 123.75,3.9 R15E8.2 124.23,5.78 v125.65,7.2 | 121.75,3.87 C18E.1 | v123.75,9.7 U$4.5 | R15E7.1 122.37,31.21 C37A.1 | C19E1.1 42.05,62.42 R15E6.2 | v19.35,73.4 18.15,73.4 17.15,74.4 15.95,74.4 12.35,70.8 12.35,60 12.95,59.4
  Top 0.406: ADUM6402-2.7 119.53,32.11 120.25,31.4 122.78,31.4 C37A.1 C36A.1 124.82,30.23 125.95,29.1 v125.95,25.3 | SV2.15 31.15,68.3 31.15,65.7
  Top 0.61: C45P.1 133.36,16.49 133.55,16.3 v133.55,15.4 133.65,15.5 | 135.73,15.72 133.88,15.72 133.65,15.5 | 133.55,16.6 133.55,15.6 133.65,15.5 | X1.5 126.16,17.19 127.65,16 127.65,7.8 124.85,4.4 124.45,4 123.95,4 123.89,4.06 C19E.1 122.12,3.86 C18E.1 121.28,3.73 119.35,2.7 116.07,2.7 U4.2 | ADUM6402-2.1 111.3,33.25 v110.65,33.9 | C30A.1 92.96,34.16 C31A.1 95.71,33.24 v95.75,33.2 | v95.75,33.2 96.27,33.2 ADUM4151.1 | 31.15,65.7 31.65,65.1 34.85,65.1 37.65,62.5 38,62.45 C18E1.1 | C18E1.1 C19E1.1 | v95.75,34.4 v95.75,33.2 | 142.05,15.3 142.05,15.6 U3.2 | v25.55,59.3 v26.95,59.3 27.35,59.3 27.45,59.4 12.95,59.4 12.45,58.9 11.35,58.9 11.25,58.8 11.15,58.8 9.75,57.4 9.75,41.5 7.45,39.2 7.45,37.3 PTC1.2 | C18E1.1 37.53,62.52 v35.85,64.2 | C30A1.1 C31A1.1 v54.95,48.4
  Top 0.813: 135.73,15.72 U3.2 | JP5.2 142.05,15.3 | 105.95,2.2 v106.85,2.2 v107.95,2.2 113.85,2.2 114.55,2.8 116.35,2.8
  Bottom 0.254: R15E1.1 104.63,13.08 105.15,13.3
  Bottom 0.305: 131.45,20.9 131.75,20.6 | v125.65,7.2 125.65,7.8 v123.75,9.7 | R15E4.1 87.17,5.62 86.75,5.2 86.75,1.8 86.85,1.7 | SV1.9 52.03,54.38 50.85,53.2 50.85,46.6 50.95,46.5 | R15E11.1 20.15,73.4 v19.35,73.4 | 105.15,13.3 105.15,7.3 v102.65,5.4 | R20E.2 95.75,31.9 v95.75,33.2
  Bottom 0.406: 131.85,22.05 SJ1.1
  Bottom 0.61: 131.85,20.7 131.85,22.05 | 128.55,17.4 130.55,15.4 v133.55,15.4 133.55,17.9 C37.+ | v110.65,33.9 110.65,34.6 111.15,35.1 | 111.15,35.1 124.15,35.1 125.95,33.3 v125.95,25.3 | v95.75,33.2 v95.75,34.4 95.75,34.5 96.35,35.1 111.15,35.1 | 40.45,56 40.55,56.4 40.35,56.6 40.35,58.5 40.05,58.8 37.05,58.8 | 37.05,58.8 32.05,58.8 31.75,58.5 28.15,58.5 27.35,59.3 v26.95,59.3 v25.55,59.3 | v35.85,64.2 37.15,62.9 37.15,58.9 37.05,58.8 | v54.95,48.4 54.95,46.5
  Bottom 0.813: X1.5 128.34,17.19 128.55,17.4 131.75,20.6 131.85,20.7 | v125.95,25.3 125.95,22.5 127.55,20.9 131.45,20.9 | v107.95,2.2 v106.85,2.2 105.95,2.2 105.45,1.7 86.85,1.7 74.35,1.7 73.45,2.6 73.45,18 74.95,19.5 H5.1 74.95,23.2 74.25,23.9 74.25,29.5 56.95,46.5 54.95,46.5 50.95,46.5 44.75,46.5 40.45,50.6 40.45,56
+3V3-L  (via drill 0.6)
  Top 0.406: L4.1 58.75,30.7 C31.1 58.35,28.85 C32.1 C33.1 C35.1 C34.1 58.9,23.45 58.95,23.3 v58.05,22.5 | v60.45,2.2 59.65,1.3 57.55,1.3 57.05,1.5 57.05,2.32 D5.A | v57.65,17.1 51.85,17.2 49.75,17.2 v49.75,16 | U$5.P$52 U$5.P$51 42.25,17.7 41.65,17.1 v41.65,13.8 v41.65,12.6 41.65,8.5 42.35,7.8 U$5.P$53
  Bottom 0.406: 58.85,23.2 58.95,23.3 58.95,23.4 58.85,23.5 58.85,23.2 | 58.85,23.2 v58.05,22.5 | v58.05,22.5 57.95,22.4 57.45,21.6 57.45,17.4 v57.65,17.1 58.15,16.3 58.15,10.6 56.75,7.7 56.75,5.6 57.15,5.3 60.85,5.3 61.45,4.6 61.45,3.2 v60.45,2.2 | 57.95,22.5 v58.05,22.5 | 49.75,17.1 v49.75,16 49.75,14.9 48.05,14.9 45.85,12.6 41.55,12.6 41.65,12.7 v41.65,13.8
+3V3-LORA
  Top 0.305: JP3.15 JP3.16
+3V3-TIME  (via drill 0.6)
  Top 0.305: U$1.VCC 43.75,28.33 42.35,29.5 42.65,29.5 v42.55,29.4 42,29.05 R18.2 | U1.P$15 49.83,30.78 49.45,30.4 48.65,30.4 v47.45,29.9
  Top 0.406: 56.65,40.3 v56.65,39.3 56.65,37.65 C24.1 C25.1 57.9,35.4 L4.2
  Bottom 0.305: JP2.9 51.7,35.25 49.65,33.7 48.35,32.7 48.35,31.1 v47.45,29.9 47.15,29.2 46.55,28.7 43.25,28.7 v42.55,29.4
  Bottom 0.406: JP2.9 52.7,35.25 53.95,36.5 53.95,37.6 56.65,40.3 v56.65,39.3
+3V3_ADE  (via drill 0.6)
  Top 0.254: ADE9000.4 108.65,51 v108.85,50.7 | ADE9000.27 98.95,51 98.84,50.89 98.74,50.89 v98.95,50.7
  Top 0.305: R3.2 114.16,53.9 v112.85,53.9 | ADE9000.1 107.12,49.4 v107.35,49.1 | C33A.1 92.98,41.61 | C32A.1 94.81,42 | 96.38,42.03 ADUM4151.20 | C34A.1 118.41,50.42 C35A.1
  Top 0.406: C33A.1 92.88,41.8 v90.35,41.8 v90.35,43.1 | C34A.1 116.43,51.28 v117.15,52
  Top 0.61: 92.98,41.61 C32A.1 | 94.81,42 96.05,42 96.38,42.03 | ADUM6402-2.16 111.78,42.7 v110.65,42.7 | v85.35,52.3 85.25,53 C10.1 C11.1
  Bottom 0.305: v112.85,53.9 112.65,53.7 | v107.35,49.1 108.65,50.6 v108.85,50.7
  Bottom 0.406: 112.65,53.7 110.55,53.7 108.85,52 v108.85,50.7 107.45,50.7 105.35,48.7 100.95,48.7 99.55,50.1 v98.95,50.7 | v117.15,52 113.15,52 112.85,52.3 v112.85,53.9
  Bottom 0.61: v90.35,41.8 95.05,45.2 99.55,50.1 | v110.65,42.7 109.85,41.9 v90.35,41.8 | v90.35,41.8 v90.35,43.1 90.35,50.4 90.05,50.9 85.65,50.9 85.35,51.8 v85.35,52.3 86.45,52.2
+3V3FUSE
  Top 0.61: PTC1.1 3.05,35.8 2.95,35.7 2.95,37.1 2.05,38 2.05,70 4.25,72.2 6.25,72.2 13.75,79.7 14.45,79.7 14.75,80 X7.1
+5V  (via drill 0.6)
  Top 0.406: v112.55,5.6 103.75,5.6 v102.55,7.1 | v101.25,14.3 101.25,15.7 101.75,16.1 101.75,17.6 100.75,18.3 98.75,21 91.9,21 X5.6 85.8,20.55 84.25,19 79.55,19 v79.35,19.2
  Top 0.61: U3.3 133.57,13 133.65,10.72
  Top 0.813: 133.77,13.04 C44P.1 135.57,13.04 U3.3 136.33,13.31 138.05,11.6 143.59,11.6 JP5.1 | 133.65,10.72 133.65,5.82 X6.2
  Bottom 0.406: 128.35,14.6 123.15,14.6 123.05,14.7 123.05,14.3 124.35,13 124.35,11.7 123.65,11 121.35,10.1 118.05,6.9 118.05,5.1 117.65,4.7 113.45,4.7 v112.55,5.6 | v102.55,7.1 102.55,12.9 v101.25,14.3 | v79.35,19.2 79.25,19.2 78.75,19.7 78.75,22.4 JP8.1
  Bottom 0.61: C36.+ 133.65,10.6
  Bottom 0.813: X1.6 128.3,14.65 128.35,14.6 130.95,12 132.25,12 133.65,10.6 133.65,5.82 X6.2
A-485-1-TX-TIME  (1 unrouted)
  Top 0.61: JP1.4 79.82,11.93 79.85,7.8 83.85,4.04
ADC1
  Top 0.305: JP4.11 6.38,66.63 6.75,67 6.75,68.3 7.75,69.3 7.75,72.5 14.15,78.8 15.15,78.8 17.05,80.7 19.35,80.7 19.75,81 19.75,82.81 X7.3
ADUM-CF1-ADE  (via drill 0.6)
  Top 0.254: ADUM4151.9 106.65,31.1 v108.15,30.2 | v111.35,12.5 111.35,9.1 113.75,8 U4.6
  Bottom 0.305: v108.15,30.2 108.15,24.2 108.75,22.7 108.75,18.1 109.05,17.5 110.05,17.5 111.35,15.4 v111.35,12.5
ADUM-CLK-ADE  (via drill 0.6)
  Top 0.254: ADUM4151.3 99.05,29.4 103.25,27.6 115.95,27.6 116.25,27.9 v118.55,27.9 | v116.95,20.5 115.45,20.5 114.85,19.8 114.85,17.4 115.35,16.9 U4.13
  Bottom 0.305: v118.55,27.9 118.55,22.6 v116.95,20.5
ADUM-IRQ1-ADE  (via drill 0.6)
  Top 0.254: ADUM6402-2.6 118.27,30.21 v117.05,29.7 | v114.05,6.9 115.85,6.9 116.12,6.5 U4.5
  Bottom 0.254: v117.05,29.7 116.95,29.7 | 114.05,7.2 v114.05,6.9
  Bottom 0.305: 116.95,29.7 115.65,28 115.65,23.7 114.75,23 114.75,14.8 115.25,13.1 115.25,9.5 114.05,7.2
ADUM-MISO-ADE  (via drill 0.6)
  Top 0.305: U$4.2 126.15,11.4 126.75,12 126.75,15.3 126.35,15.7 126.05,15.9 121.45,15.9 120.75,16.4 120.75,20.4 121.55,21 124.25,21 124.65,21.4 v124.65,28.7 | v110.15,28.9 109.55,28.7 104.45,28.7 101.55,30.5 ADUM4151.5
  Bottom 0.305: v124.65,28.7 122.25,31 112.95,31 v110.15,28.9
ADUM-MOSI-ADE  (via drill 0.6)
  Top 0.254: ADUM4151.4 100.35,30.3 103.95,28.1 110.85,28.1 v112.05,28.8 | v111.25,23.6 111.25,20.8 U4.16
  Bottom 0.254: 112.05,24.3 111.95,24.2
  Bottom 0.305: v112.05,28.8 112.05,24.3 | 111.95,24.2 v111.25,23.6
ADUM-PM1-ADE  (via drill 0.6)
  Top 0.254: U4.27 98.45,15.6 v100.25,15.4 | ADUM4151.7 104.15,31.3 v105.35,29.6
  Bottom 0.254: R15E1.2 R15E2.1
  Bottom 0.305: v100.25,15.4 103.85,15.4 R15E1.2 104.85,17.2 103.95,18.4 103.35,19.5 103.35,27.9 v105.35,29.6
ADUM-PPS-NEO8  (via drill 0.6)
  Top 0.254: 51.05,53.4 52.95,53.4 54.85,52.2 | 77.75,29.1 v78.35,28 | v114.95,29 115.65,28.8 119.25,28.8 120.05,27.9 120.05,10.1 119.25,9.2 116.85,9.2 U4.7
  Top 0.305: SV1.8 49.88,52.23 51.05,53.4 | 54.85,52.2 77.75,29.1 | v80.95,25.5 82.65,25 113.55,25 v114.45,24.4
  Bottom 0.254: v78.35,28 v80.95,25.5
  Bottom 0.305: v114.45,24.4 114.45,27.8 v114.95,29
ADUM-RESET-ADE  (via drill 0.6)
  Top 0.254: U4.26 98.06,17.1 v100.85,17.1 | ADUM4151.8 105.45,32.9 v105.45,31.2
  Bottom 0.254: v105.45,31.2 105.25,31.2
  Bottom 0.305: v100.85,17.1 102.15,18.3 102.15,28.5 105.25,31.2
ADUM-RXD1-NEO8  (via drill 0.6)  (1 unrouted)
  Top 0.254: v81.65,24.3 82.55,24.2 109.65,24.2 110.25,23.9 U4.17
  Top 0.305: SV2.18 37.95,64.2 41.85,64.2 43.95,62.1 46.95,62.1 47.25,61.8 v47.25,57.4
  Bottom 0.254: SV1.5 47.82,54.77 48.95,55.9 50.55,55.9 51.15,56.5 53.15,56.5 53.95,55.6 53.95,52.6 77.05,29.2 77.55,27.5 77.95,27 80.05,24.9 80.55,24.5 80.85,24.4 v81.65,24.3
  Bottom 0.305: v47.25,57.4 47.25,55.07 SV1.5
ADUM-SS-ADE  (via drill 0.6)
  Top 0.254: v102.85,31.1 102.85,31.5 ADUM4151.6
  Top 0.305: U4.23 102.59,18.86 103.15,18.3 103.15,17.9 v103.35,17.4
  Bottom 0.254: 100.95,16.1 99.85,16.5 | 102.25,30.5 v102.85,31.1
  Bottom 0.305: v103.35,17.4 101.85,16.1 100.95,16.1 | 99.85,16.5 99.85,18.4 100.85,19.8 100.85,27.6 100.85,28.4 102.25,30.5 99.65,30.5 R20E.1
ADUM-TXD1-NEO8  (via drill 0.6)
  Top 0.254: v83.15,23.2 84.05,23.5 108.45,23.5 108.95,23 U4.18
  Top 0.305: SV2.17 35.48,69.77 36.15,69.1 36.15,66.9 38.15,64.9 42.05,64.9 44.25,62.7 47.15,62.7 47.95,61.9 47.95,58.2 48.35,57.8 48.35,57.6 v48.55,57.4 | v50.25,56.8 49.75,56 49.65,55.9 48.95,55.9 48.25,55.3 48.25,53.53 SV1.6
  Bottom 0.254: SV1.6 46.98,52.23 48.25,53.5 49.95,53.5 50.75,54.3 50.75,55.3 51.45,56 52.75,56 53.25,55.5 53.25,52.9 53.35,52.8 53.35,52 76.25,28.9 76.55,27.1 77.25,26.3 80.25,23.2 v83.15,23.2
  Bottom 0.305: v48.55,57.4 49.05,56.8 v50.25,56.8
ADUM-ZEROCROSS-ADE  (via drill 0.6)
  Top 0.254: ADUM6402-2.5 116.85,33.25 116.85,31.1 116.55,30.8 115.05,30.8 | v114.55,5.6 116.11,5.6 U4.4
  Top 0.305: v113.65,29.7 113.95,29.7 115.05,30.8
  Bottom 0.305: v114.55,5.6 113.65,5.9 113.05,6.5 113.05,7.5 114.25,9.6 114.25,13.2 113.75,14.8 113.75,21.7 113.25,22.2 113.25,29.3 v113.65,29.7
AGND  (via drill 0.6)  (3 unrouted)
  Top 0.254: 108.05,32.7 107.95,33.33 ADUM4151.10 | 115.75,33.23 ADUM6402-2.4 | U$4.3 125,12.35 124.35,11.7 124.35,11.4 124.05,11.1 122.45,11.1 121.95,10.6 121.95,9.9 121.65,9.6 121.65,9.2 121.35,8.9 120.95,8.9 120.65,8.6 120.65,6 120.75,5.9 121.7,5.9 C40U1.1
  Top 0.305: v130.15,9.4 129.88,9.4 128.77,10.5 | U$4.3 125.6,12.55 v125.65,13.4 | v93.25,3 93.25,1.9 92.95,1.6 | SV1.7 48.92,53.37 48.15,52.6 48.15,46.7 48.65,45.1
  Top 0.406: C30A.2 93.66,32.26 C31A.2 95.35,31.4 97.49,31.34 97.85,31.6 97.85,32.82 ADUM4151.2 | U4.15 112.65,19.75 112.65,14 112.05,13.4 v108.75,13.4 107.95,13.18 101.55,13.2 | U4.24 101.32,18.93 102.45,18 102.45,14.3 101.55,13.2 | 101.55,13.2 101.55,9.3 | 101.55,9.3 101.55,1.5 102.65,1.1 | X5.5 89.75,18.4 85.75,18.4 84.75,17.5 84.75,9.6 85.65,5.7 85.65,1.8 | U4.GND 101.55,9.3
  Top 0.61: C36A.2 C37A.2 122.81,33.25 ADUM6402-2.8 120.91,33.25 120.95,33.3 120.95,34.8 120.65,35.1 116.15,35.1 | 116.15,35.1 115.75,34.7 115.75,33.28 ADUM6402-2.4 ADUM6402-2.3 ADUM6402-2.2 | ADUM4151.2 97.78,34.64 98.45,35.1 108.55,35.1 | 108.55,35.1 116.15,35.1 | ADUM4151.10 107.95,35 108.55,35.1 | SV2.14 SV2.13 29.85,67.1 29.85,65 30.65,63.9 34.45,63.9 37.85,60.5 C18E1.2 C19E1.2 42.33,59.6 41.55,60.5 42.45,59.5 42.45,56.9 41.85,56.3 40.95,56.3 40.45,55.5 | C31A1.2 C30A1.2 54.25,45.1
  Top 0.813: 134.42,18.39 C45P.2 129.86,18.39 128.86,17.39 | 134.42,18.39 135.36,18.39 U3.1 | 128.86,17.39 128.77,17.3 128.77,13.4 | 134.42,18.39 134.4,21.18 136.7,21.25 v134.45,21.2 134.45,25.5 126.7,33.25 122.81,33.25 | C44P.2 131.48,13.3 128.88,13.3 128.77,13.4 | 128.77,13.4 128.77,10.5 128.77,6.03 X6.1 127.71,3.46 126.05,2.1 123.86,2.1 C19E.2 121.52,1.73 C18E.2 121.25,1.7 120.25,1.2 115.5,1.2 U4.1 114.6,1.1 102.65,1.1 97.55,1.1 97.85,1.6 U4.38 92.95,1.6 85.65,1.8 74.55,1.6 73.45,2.5 73.45,17.9 74.65,19.1 74.85,19.1 | X1.4 126.52,19.73 128.86,17.39 | 75.75,19.1 77.55,20.9 77.55,21 77.45,21.1 | 77.55,21.1 H5.2 77.45,21.1 | 77.45,21.1 75.75,19.1 | 75.75,19.1 74.85,19.1 | 74.85,19.1 73.45,18 73.15,18.5 73.15,22.9 74.15,24 74.15,29.6 58.25,45.1 54.25,45.1 48.65,45.1 45.05,45.2 40.45,50.7 40.45,55.5
  Bottom 0.254: R15E2.2 108.83,13.18 v108.75,13.4
  Bottom 0.305: v125.65,13.4 127.75,13.4 v130.15,9.4 | C40U2.1 92.45,3.8 v93.25,3 | 14.93,72.18 R15E10.2 14.45,72.66 14.45,73.3 16.05,74.9 17.45,74.9 19.25,76.6 22.95,76.6 23.75,76.8 TP3.TP 24.25,76.8 24.45,77
  Bottom 0.406: 14.93,72.18 12.45,69.7 12.45,61.4 13.7,60.15 | 24.45,77 29.45,77 TP1.TP
  Bottom 0.61: X7.5 24.92,84.53 23.85,85.6 13.85,85.6 12.85,84.6 12.85,78.8 6.25,72.2 4.15,72.2 1.95,70 1.95,40.3 3.75,38.5 8.15,38.5 9.75,40.1 9.75,57.4 11.15,58.8 12.35,58.8 13.7,60.15 14.35,60.8 25.05,60.8 29.85,65.6 29.85,67.21 SV2.14 | C37.- 141.05,16.1 C36.- 140.95,18.3 140.95,21.12
  Bottom 0.813: 144.02,22.9 144,21.7 143.05,21.12 140.95,21.12 137.97,21.12 v134.45,21.2
  other vias: 2.05,32 2.95,23.4 7.15,28.9 6.45,77.6 2.35,74.7 10.15,82.5 28.85,85.9 35.85,86 46.05,86.2 50.05,71.3 55.35,65.9 56.55,86.2 42.15,72.6 49.05,60 42.75,45 17.45,65 18.65,71.8 21.05,72.4 33.15,61.6 11.05,61.8 52.25,49 50.65,43.8 46.55,49 25.55,64.3 28.75,60.2 74.95,9.7 131.95,10.1 98.05,28.5 119.45,5.3 81.35,11.5 83.45,6.9 81.65,9 110.45,31.5 140.65,32.7 138.35,23.1 144.55,29.5 137.65,9.7 143.65,9.7 130.85,7.2 137.75,2 137.45,5.7 129.55,1.7 60.35,75.3
  pour Top (isolate 0.61): 0.05,87.2 67.15,87.2 67.35,87 67.35,59.7 67.75,59.3 67.75,58.8 73.35,53.2 75.25,53.2 77.25,51.2 78.35,51.2 78.55,51 78.55,48.1 78.05,47.6 78.55,47.6 88.55,37.6 146.35,37.6 146.65,37.9 146.65,0.4 146.75,0.3 120.75,0.3 115.25,0.1 106.55,0.2 100.55,0.3 72.95,0.3 72.05,0.2 71.95,29.7 71.85,30.2 71.65,30.6 59.45,42.7 39.95,42.7 39.85,42.6 39.85,57.7 11.25,57.7 11.05,57.9 11.05,57.7 9.95,56.6 9.95,0.4 10.15,0.2 0.15,0.2 0.15,87.1
  pour Bottom (isolate 0.61): 0.05,87.2 67.15,87.2 67.25,87.1 67.25,58.7 67.85,58.7 73.15,53.4 77.85,53.4 78.15,53.7 78.15,47.7 78.25,47.6 78.45,47.6 88.15,37.9 146.45,37.9 146.85,37.5 146.85,0.3 146.95,0.2 106.65,0.2 98.55,0.3 88.75,0.2 72.15,0.2 71.95,0.6 71.95,29.4 71.75,30.4 59.75,42.3 40.05,42.3 39.75,42.6 39.75,57.5 39.45,57.8 11.25,57.8 10.15,56.7 10.15,0.2 10.05,0.1 0.15,0.1 0.05,0.2 0.05,87.1 -0.15,87.3
AGND-LORA
  Top 0.305: JP3.13 JP3.14
  pour Bottom (isolate 0.61): 12.15,56.5 38.55,56.5 38.45,0.7 24.45,0.7 12.85,0.1 10.95,0.3 11.55,56 11.45,56.3
  pour Top (isolate 0.61): 11.55,56.6 11.55,20.8 11.65,20.7 10.95,0.5 11.35,0.1 24.35,0.7 38.25,0.7 38.45,0.9 38.45,56.3 38.65,56.5 11.65,56.5
AGND-TIME  (via drill 0.6)  (2 unrouted)
  Top 0.254: 49.45,35.3 49.45,35.4
  Top 0.305: JP2.7 49.49,35.16 | 53.75,31.93 U1.P$9 | U$1.GND 46.15,32.4 v47.45,31.6 | U$5.P$81 65.75,18.65 | 43.85,16.5 42.95,16.4 U$5.P$50 | v54.65,28.3 55.4,28.3 55.75,28.65 | Q8.2 52.85,2.4 47.4,2.35 45.75,3.9 45.75,6.25 | U$5.P$42 44.75,19.3 U$5.P$70
  Top 0.406: JP2.7 50.85,36.61 50.85,39 51.45,39.6 53.25,39.6 54.05,38.9 54.55,38.4 54.55,37.75 C24.2 C25.2 54.7,32.88 54.49,32.66 | 54.49,32.66 U1.P$9 | 54.49,32.66 55.55,31.6 C31.2 55.75,30.3 55.75,28.65 C32.2 56.1,28.95 56.45,29 56.85,27.5 | 56.85,27.5 56.85,26.05 | 56.85,26.05 C33.2 56.7,27.45 56.85,27.5 | 56.85,26.05 56.95,26.05 C35.2 C34.2 57.2,24.15 56.65,23.6 55.95,23.6 55.3,23.6 C40U3.2 | U$5.P$80 52.15,18.8 U$5.P$35 U$5.P$36 U$5.P$37 | U$5.P$37 49.95,20.3 | U$5.P$37 49.95,18.9 49.65,18.6 U$5.P$78 U$5.P$76 U$5.P$70 | U$5.P$34 U$5.P$33 U$5.P$32 U$5.P$31 U$5.P$30 U$5.P$29 U$5.P$28 | U$5.P$93 63.15,18.55 | 63.15,18.55 U$5.P$87 | U$5.P$25 63.15,18.55 | U$5.P$87 U$5.P$88 U$5.P$82 65.95,15.5 | U$5.P$87 U$5.P$81 | U$5.P$22 U$5.P$23 65.35,19.1 65.75,18.65 66.15,18.8 U$5.P$64 U$5.P$63 | 65.95,15.5 U$5.P$61 U$5.P$60 | U$5.P$92 U$5.P$91 U$5.P$85 65.65,12.2 | U$5.P$92 U$5.P$94 U$5.P$5 | U$5.P$10 U$5.P$9 57.65,7.7 U$5.P$96 59.85,7.5 U$5.P$7 U$5.P$6 | U$5.P$92 64.25,7.2 U$5.P$3 65.35,6.3 U$5.P$2 U$5.P$1 | U$5.P$55 U$5.P$54 66.75,8 | 66.75,8 U$5.P$86 | 66.75,8 U$5.P$92 | U$5.P$57 U$5.P$58 | U$5.P$58 U$5.P$84 65.65,12.2 | 65.65,12.2 U$5.P$90 | U$5.P$89 U$5.P$83 65.95,15.5 | U$5.P$58 U$5.P$59 | 43.85,16.5 44.65,16.5 | 44.65,16.5 U$5.P$69 | 44.65,16.5 46.45,16.5 U$5.P$75 U$5.P$74 | U$5.P$74 48.45,14.9 | U$5.P$49 U$5.P$48 | U$5.P$48 U$5.P$47 43.55,14.4 45.15,14.3 U$5.P$74 | U$5.P$48 U$5.P$68 | U$5.P$15 U$5.P$14 52.15,7.3 U$5.P$79 | U$5.P$17 U$5.P$77 U$5.P$71 | U$5.P$21 U$5.P$20 U$5.P$19 46.65,7.3 U$5.P$71 | U$5.P$71 U$5.P$72 | U$5.P$72 U$5.P$73 45.25,12.3 44.25,12.3 43.55,12.1 U$5.P$45 U$5.P$46 U$5.P$67 | U$5.P$65 U$5.P$71
  Top 0.406: U$5.P$43 U$5.P$44 U$5.P$66 U$5.P$72 | U$5.P$72 47.65,10.1 v48.7,9.45
  Top 0.61: X4.2 70.73,3.17 70.85,3.4 | 70.75,3.3 70.85,3.4 | 70.85,3.4 70.85,9.9 69.35,11.1 U$5.P$57 | 55.95,23.6 56.55,23 U$5.P$31 56.55,18.7 56.75,18.5 58.45,18.5 U$5.P$95 | U$5.P$29 58.75,16.4 | 58.75,16.4 58.95,15.89 | 58.95,15.89 60.65,11.4 | 60.65,11.4 60.65,9.1 U$5.P$96 | U$5.P$88 63.8,16.45 63.75,16.5 v61.95,16.5 58.85,16.5 58.75,16.4 | U$5.P$91 60.7,10.15 60.65,11.4 | U$5.P$73 47.45,12.3 48.85,12.3 49.92,13.46 | 49.92,13.46 50.7,14.32 | 50.7,14.32 52.15,15.9 52.55,15.9 58.95,15.89 | U$5.P$79 52.45,12.7 50.7,14.32 | U$5.P$78 48.45,17.5 v48.45,16.4 48.45,14.9 49.92,13.46 | U$5.P$1 66.55,5.5 v66.05,4.1 v66.05,1.7 67.75,2.6 X4.1
  Bottom 0.305: v47.45,31.6 47.44,32.9 49.35,34.6 JP2.7 | D6.5 D6.2 51.05,30.7 51.35,31 52.75,31 53.45,30.3 53.45,29.5 v54.65,28.3 | U$3.- v61.95,16.5
  Bottom 0.406: C30.2 C29.2 48.4,9.15 v48.7,9.45 49.15,9.9 50.7,9.9 C26.2 C27.2 C28.2 | J9.C5 46.65,15.3 48.4,15.95 v48.45,16.4
  other vias: 40.55,33 59.45,38.9 56.15,33.2 61.15,27.6 61.15,36.8 68.65,29.3 68.25,25.8 51.45,1.3 48.55,1.3 44.75,1.4 44.35,3.9 41.35,5.7 41.25,2.2 40.45,9.9 40.45,17.8 40.65,26.7
  pour Top (isolate 0.61): 39.45,40.7 39.45,28.7 39.25,0.1 71.85,0 71.95,30.3 59.35,41.6 39.75,41.8
  pour Bottom (isolate 0.61): 39.25,41.1 39.55,28 39.45,0.1 72.05,0.3 71.85,28.1 72.15,30.1 59.35,41.6 40.55,41.3
AVDDOUT
  Top 0.254: 98.25,52 98.26,51.99 ADE9000.25
  Top 0.305: C6.1 C7.1 93.25,53.27 93.25,55.4 93.35,55.3 95.45,55.3 96.45,54.3 96.45,53.2 97.65,52 98.25,52
B-485-1-RX-TIME  (1 unrouted)
  Top 0.61: JP1.6 78.08,12.27 78.05,7.1 80.35,4.06
CF1_ADE
  Top 0.254: 101.45,47.5 101.55,47.7 102.25,48.61 ADE9000.33
  Top 0.305: ADUM4151.12 106.85,43.86 107.25,44.1 107.95,44.7 107.95,45.5 107.55,45.9 101.75,45.9 101.45,46.1 101.45,47.5
CLKIN
  Top 0.254: Q1.3 91.9,50.42 C9.1 92.55,50.49 92.55,51 92.75,51.2 95.15,51.2 96.45,49.6 96.65,49.4 96.76,49.39 99.55,49.4 100.14,49.99 ADE9000.29
CLKOUT
  Top 0.254: Q1.1 87.23,48.02 87.35,48 88.65,46.7 91.45,46.7 91.65,46.9 91.65,47.56 C8.1 92.15,48.06 92.15,47.9 93.05,47 95.35,47 96.35,48 96.35,48.5 96.64,48.89 99.75,48.9 100.34,49.49 ADE9000.30
CRS
  Top 0.254: 25.95,70.3 27.15,71.5 36.25,71.5 39.25,68.5 | 56.05,55.4 56.05,55 58.15,52.9 59.55,52.9 | 81.35,31.1 83.35,29.7 84.95,28.1 86.45,26 87.25,25.6 117.55,25.6 117.85,25.2 117.85,16.1 117.55,15.6 U4.12
  Top 0.305: SV2.10 24.98,67.23 25.95,68.1 25.95,70.3 | 39.25,68.5 43.95,68.5 56.05,55.4 | 59.55,52.9 81.35,31.1
DAC1
  Bottom 0.305: JP4.10 6.24,64.09 8.45,66.8 8.45,72.3 14.45,78.2 15.65,78.2 17.45,80 21.75,80 22.35,80.6 22.35,82.87 X7.4
DVDDOUT
  Top 0.254: 109.95,50.2 109.44,49.89 108.56,49.89 107.95,50.5 ADE9000.3
  Top 0.305: C2.1 112.13,50.45 C3.1 112.08,50.5 111.45,50.1 110.75,50.2 109.95,50.2
ESP_RESET  (via drill 0.6)  (1 unrouted)
  Top 0.254: v93.95,7.8 93.95,9.5 93.45,10.4 X5.2
  Top 0.305: v113.65,3.6 114.55,4.1 U4.3
  Bottom 0.305: 90.01,6.04 D1.C 90.01,3.89 C40U2.2 88.27,3.8 R15E4.2 | X5.2 | 90.05,5.9 91.65,5.9 92.45,6.5 92.95,6.9 94.05,6.9 94.55,6.3 | 94.55,6.3 94.55,4.5 95.15,3.8 110.65,3.8 111.35,4.3 112.75,4.3 v113.65,3.6 | 94.55,6.3 v93.95,7.8
GND-485-1  (1 unrouted)
  Top 0.61: JP1.8 76.64,11.81 76.65,4.9 76.75,4.04
GND-ADE900  (via drill 0.6)
  Top 0.254: C9.2 C8.2 | ADE9000.18 102.25,54.51 102.25,54.9 102.45,55.1 | 102.45,55.1 102.73,54.92 | 102.73,54.92 ADE9000.17 102.75,54.9 | 104.73,54.92 ADE9000.13 | ADE9000.14 104.25,54.51 104.25,55.1 103.95,55.1 103.75,54.9 103.75,54.51 ADE9000.15 103.75,54.47 103.75,53.5 103.2,52.95 103.2,52.75 | 102.73,54.92 102.75,54.9 | 102.75,53.2 103.2,52.75 | 103.2,52.75 103.48,52.47 ADE9000.GND | 109.95,49.6 109.45,49.4 108.35,49.4 107.76,49.99 ADE9000.2 | 102.75,54.9 102.45,55.1 | 102.45,55.1 v102.45,56.5 | ADE9000.26 99.46,51.49 99.25,51.5 98.45,51.5 98.05,51.2 98.05,50.7 | ADE9000.28 | 100.65,50.49 ADE9000.28 | ADE9000.28 99.95,50.5 99.45,49.9 98.35,49.9 98.05,50.4 98.05,50.7 | 98.05,50.7 97.15,50.7 v97.05,50.8
  Top 0.305: R5.2 C13.1 C12.1 86.05,61.8 86.35,61.7 R2.2 82.4,61.85 v82.15,62.1 | C200.1 93.75,62.5 C100.1 R104.2 | C200.1 R200.2 | 74.65,61.6 C15.1 | 74.65,61.6 C16.1 R11.2 74.6,63.65 74.55,63.6 74.55,61.6 74.65,61.5 73.05,61.5 v72.55,62 | 74.65,61.6 R10.2 | C19.2 135.15,60.4 | 135.25,59.7 134.35,58.3 130.05,58.3 128.6,59.75 C18.1 128.6,63 SP1.1 | 135.25,60.6 135.25,60.75 C19.2 | C19.2 135.2,63 SP@.2 135.15,62.95 135.15,60.7 135.25,60.6 | 135.25,60.6 135.25,59.7 | 135.25,59.7 135.75,59.2 v135.75,59 | SP@1.2 124.55,60.55 C21.2 124.25,60.25 124.25,59.3 | C20.1 118.2,62.4 SP2.1 118.15,58.7 119.05,57.8 123.25,57.8 | SP@2.2 114.7,62.35 114.75,62.4 114.75,60.65 C23.2 114.25,60.15 114.25,58.7 | 114.25,58.7 113.25,57.8 108.35,57.8 107.45,58.7 SP3.1 107.6,62.3 C22.1 107.6,60.05 107.35,59.8 107.35,58.7 108.25,57.8 113.35,57.8 114.25,58.7 | 123.25,57.8 124.25,58.8 124.25,59.2 | 124.25,59.3 124.95,58.6 v125.25,58.6 124.85,58.6 124.25,59.2 | 114.25,58.7 v114.65,58.4 114.35,58.7 114.25,58.7 | C1.2 120.48,54.4 v121.75,54.4 121.75,53.6 121.05,53 116.85,53 115.25,51.5 115.25,48.7 | C5.2 102.25,60.16 102.26,60.15 C4.2 | 102.95,62.3 103.25,62.3 | 109.95,49.6 110.65,49.6 111.15,49.1 111.48,49.1 C3.2 112.13,48.55 C2.2 114.11,48.5 115.05,48.5 115.25,48.7 | C6.2 C7.2 | ADE9000.2 | 104.75,50 103.48,51.27 ADE9000.GND 102.89,51.74 102.65,51.5 102.65,50.6 102.75,50.5 | C200.1 92.21,61.96 v92.05,61.8 | 123.25,57.8 123.25,57.9 124.15,58.8 124.15,59.2 124.25,59.3 | 124.25,59.3 124.25,59.2 | 104.73,54.92 104.55,55.1 104.25,55.1 | 118.41,48.52 C35A.2 | C34A.2 116.34,48.52 116.15,48.7 115.25,48.7
  Top 0.406: 104.25,55.1 v104.25,55.5 v104.25,56.6 | C11.2 90.45,55.6 | C7.2 v89.45,53.2 | v97.95,44.8 97.75,44.8 95.65,44.8 94.95,44.9 | 94.95,44.8 95.35,45 94.75,45 v93.75,45.6
  Top 0.61: 102.25,60.16 102.25,61.6 102.95,62.3 | C33A.2 94.37,43.46 C32A.2 94.95,44.8 | ADUM6402-2.9 120.85,42.88 120.85,43.8 120.55,44.1 | 120.55,44.1 120.35,44.3 119.85,44.3 | 119.85,44.3 119.53,43.98 ADUM6402-2.10 | ADUM4151.19 97.75,43.47 | 97.75,43.47 97.75,43.1 | 97.75,43.47 97.75,44.8 98.15,44.7 97.95,44.9 v96.45,44.9 94.95,44.9 94.95,44.8 | 120.85,43.9 120.55,44.1 | ADUM6402-2.15 113.25,42.89 113.25,44.4 v113.15,44.6 | ADUM4151.11 108.05,43.72 v108.85,44.5 | v100.75,62.3 v101.85,62.3 103.25,62.3 | v105.55,62.2 v104.35,62.2 103.55,62.2 103.25,62.5 | C10.2 C11.2 | 90.45,55.6 C6.2 | C8.2 v95.75,49 | v92.65,46.1 94.95,44.8 | C34A.2 118.41,48.52 | C35A.2 119.22,48.53 119.75,48 119.75,45.2 v119.85,45.1 119.85,44.3
  Top 2.184: X2.1 93.11,82.9 98.15,81.5 103.25,76.4 103.25,62.5 103.25,62.3
  Bottom 0.254: v102.45,56.5 103.65,56.5 v104.25,56.6
  Bottom 0.305: Q3.3 135.35,62.9 | 135.35,62.9 134.35,61.9 129.25,61.9 128.15,63 Q2.3 128.15,66.4 128.75,67.2 129.85,67.2 130.55,66.5 130.55,66.05 R20.2 | 114.45,62.5 113.45,61.5 108.55,61.5 107.25,62.8 Q6.3 107.45,63.6 107.45,66.5 107.75,66.9 108.85,66.9 109.35,66.6 109.45,66.6 109.45,66.1 110.7,64.85 R48.2 | 114.45,62.5 114.45,63.3 Q7.3 | R34.2 120.9,64.75 119.95,65.7 119.95,66.5 119.75,66.7 119.75,66.8 119.65,66.9 118.05,66.9 117.45,66.3 117.45,63.5 Q4.3 117.55,63.3 117.65,63.2 117.65,62.5 118.65,61.5 123.95,61.5 124.85,62.4 | 124.85,62.4 124.85,63.3 Q5.3 | v121.75,54.4 121.65,54.4 | 135.25,60.9 135.35,60.8 135.75,60.8 v135.75,59 135.75,62.4 135.35,62.9 | v114.65,58.4 114.65,60.5 SP@2.2 114.45,62.5 | v125.25,58.6 125.25,60.4 125.35,60.5 | 124.85,62.4 124.85,62.1 125.25,61.7 125.25,60.5 | v97.05,50.8 95.75,50.9
  Bottom 0.406: v105.55,62.2 105.55,59.1 104.25,57.6 v104.25,56.6 v104.25,55.5 | v89.45,53.2 89.45,51.7 90.65,51.7 91.45,50.9 91.45,49.6 92.05,49 v95.75,49 95.65,48.9 95.35,48.9 95.05,48.6 94.95,48.6 94.55,48.2 94.35,48.2 94.35,46.3 v93.75,45.6 | v113.15,44.6 108.65,44.6 108.15,44.1 107.75,44.1 | 107.15,43 107.05,42.9 98.55,42.9 98.45,43 98.05,44.2 v97.95,44.8
  Bottom 0.61: v96.45,44.9 97.55,44.9 v97.95,44.8 98.15,44.3 98.55,43 107.15,43 107.75,43.6 107.75,44.1 v108.85,44.5 108.95,44.6 v113.15,44.6 114.45,43.2 118.35,43.2 118.75,43.6 118.75,44.8 119.05,45.1 v119.85,45.1 121.55,45.1 121.75,45.3 121.75,48.6 123.65,52.4 HKLP1.P$2 | 101.65,62.3 v100.75,62.3 99.15,60.7 93.35,60.7 92.25,61.8 v92.05,61.8 91.95,61.7 90.85,61.7 90.15,61 84.05,61 82.95,62.1 v82.15,62.1 82.05,62 80.65,62 79.45,60.8 74.05,60.8 72.85,62 v72.55,62 | 135.25,60.9 125.65,60.9 125.55,60.8 125.55,60.7 125.35,60.5 125.25,60.5 114.65,60.5 107.25,60.5 105.65,62.1 105.45,62.1 | 104.35,62.1 105.45,62.1 | 105.45,62.1 v105.55,62.2 | v92.65,46.1 v93.75,45.6 94.35,46.4 94.35,48.2 v95.75,49 95.75,50.9 95.75,53.7 100.95,58.9 100.95,59 101.55,59.6 101.55,62 v101.85,62.3
  other vias: 123.95,46.5 82.55,56.1 88.05,45.3 72.55,60.1 82.35,60.3 107.95,55.9 100.05,55.8 124.65,54.7 135.05,56.2 126.45,71.3 116.05,70.4 98.85,46.9 109.85,47.7
  pour Top (isolate 0.61): 67.65,87.2 67.65,59 67.85,58.8 69.25,58.8 74.05,54 78.35,54 78.75,53.6 78.75,47.5 80.25,46 80.55,46 88.75,37.8 145.75,37.8 146.05,38.1 146.05,87.1 145.95,87.2
  pour Bottom (isolate 0.61): 67.55,87 68.15,58.5 73.05,53.6 78.05,53.6 78.15,53.5 78.15,47.5 79.65,46 79.95,46 87.85,38.1 146.55,38.1 147.05,38.6 147.05,87.3 146.95,87.4 68.35,87.3 67.95,87.2
GND-IN12
  Top 0.305: JP4.7 6.02,56.47 6.65,57.1 6.65,59.6 7.85,60.8 7.85,64.9 9.15,66.6 9.15,72 14.75,77.5 15.95,77.5 17.75,79.3 21.95,79.3 22.55,79.9 31.45,79.9 32.35,80.8 32.34,82.79 32.65,82.79 X7.8
GND-IO1/4
  Top 0.305: X8.1 63.75,80 62.75,79 33.75,79 32.55,77.8 23.45,77.8 22.85,77.2 18.95,77.2 17.05,75.3 15.65,75.3 11.35,70.9 11.35,65.5 10.05,63.9 10.05,60 8.85,58.5 8.85,43.4 6.75,41.3 4.62,41.3 JP4.1
GPIO1
  Top 0.305: R19.2 48.55,4.45 49.95,5 U$5.P$16
IAN  (via drill 0.6)
  Top 0.254: 109.55,53 109.54,52.99 ADE9000.8
  Top 0.305: R36.2 133.3,62.4 C19.1 132.95,60.45 v132.95,59.3 | v130.45,57.4 130.25,57.2 122.85,57.2 121.75,56.1 120.75,56.1 120.15,56.6 118.65,56.6 117.95,56 112.75,56 109.65,53 109.55,53
  Bottom 0.305: v132.95,59.3 132.25,59.9 132.05,60.1 130.95,60.1 130.45,59.6 v130.45,57.4
IAP  (via drill 0.6)
  Top 0.254: 110.15,52.5 109.86,52.49 ADE9000.7
  Top 0.305: R35.2 130.5,62.4 C18.2 130.75,60.55 v131.55,59.2 | v131.85,57.4 131.55,57.1 131.55,56.9 130.95,56.3 130.15,56.3 129.85,56.6 123.15,56.6 122.15,55.6 120.15,55.6 119.55,55.9 119.25,55.9 118.75,55.5 113.15,55.5 110.15,52.5
  Bottom 0.305: v131.55,59.2 131.55,57.8 131.85,57.5 v131.85,57.4
IBN  (via drill 0.6)
  Top 0.254: 108.85,54 108.84,53.99 ADE9000.10
  Top 0.305: R31.2 122.55,60.55 C21.1 122.6,58.95 v122.55,58.9 | v117.45,58 116.45,57.3 112.35,57.3 111.85,56.9 111.55,56.5 109.05,54 108.85,54
  Bottom 0.305: v122.55,58.9 121.75,59.6 120.65,59.6 119.55,58 v117.45,58
IBP  (via drill 0.6)
  Top 0.254: 109.25,53.5 109.14,53.49 ADE9000.9
  Top 0.305: C20.2 120.15,60.45 R30.2 120.15,59.2 120.45,59 v121.15,58.7 | v121.25,57 120.45,57.2 118.35,57.2 117.75,56.7 112.55,56.7 109.45,53.6 109.25,53.5
  Bottom 0.305: v121.15,58.7 121.15,57.2 v121.25,57
ICN  (via drill 0.6)
  Top 0.254: 105.25,54.51 ADE9000.12 105.23,57.18 105.25,57.2
  Top 0.305: R45.2 112.65,60.45 C23.1 112.7,58.95 v112.55,58.8 | v106.85,57.8 105.75,57.8 105.25,57.3 105.25,57.2
  Bottom 0.305: 112.45,58.5 v112.55,58.8 111.65,59.6 110.45,59.6 109.35,57.8 v106.85,57.8
ICP  (via drill 0.6)
  Top 0.254: 105.75,54.51 ADE9000.11 105.73,56.78 105.75,56.8
  Top 0.305: R44.2 109.5,62.05 109.55,62 109.55,60.45 C22.2 110.6,59.15 v110.95,58.7 | v110.55,56.9 109.65,57.2 107.75,57.2 107.15,56.8 106.65,56.8 106.35,57.1 106.05,57.1 105.75,56.8
  Bottom 0.305: v110.95,58.7 110.95,57.1 v110.55,56.9
IL1+
  Bottom 0.305: 128.75,74.45 129.15,74.9
  Bottom 0.61: R23.1 128.75,74.45
  Bottom 2.54: 0.05/2W1.1 135.42,74.9 129.15,74.9 129.07,79.08 X3.2
IL1-  (via drill 0.6)
  Top 0.305: v132.85,72.6 132.57,72.88
  Top 0.61: 132.57,72.88 132.67,82.02 X3.1
  Bottom 0.61: R24.1 134,72.6 v132.85,72.6
  Bottom 2.54: X3.1 133.69,79.3 136.55,79.3 140.95,73.1 143.55,73.1 145.65,71.8 145.65,63.5 143.88,61.73 0.05/2W1.2
IL2+
  Bottom 0.305: 118.6,72.1 R37.1
  Bottom 0.61: R37.1 118.3,71.7 118.35,71.7 114.67,75.38 0.05/2W2.1
  Bottom 2.54: X3.4 117.15,82.3 117.15,79.6 114.67,76.12 0.05/2W2.1
IL2-
  Bottom 0.61: R38.1 123.83,72.28 0.05/2W2.2
  Bottom 2.54: X3.3 123.05,81.48 122.95,76.5 123.55,75.9 0.05/2W2.2
IL3+  (via drill 0.6)
  Top 0.61: v109.75,72 106.75,75 X3.6
  Bottom 0.61: R49.1 109.2,72 v109.75,72
  Bottom 2.54: X3.6 103.85,79.44 103.85,78.9 103.95,79.1 0.05/2W.1
IL3-  (1 unrouted)
  Bottom 0.61: R50.1 113.8,72 111.55,72 111.15,72.4 111.15,73.6 109.96,74.79 109.04,74.79
  Bottom 2.54: X3.5 111.95,82.42 111.95,82 109.05,79.1 109.04,74.79 109.05,74.4 104.05,71.3 103.95,69
IN1
  Bottom 0.305: JP4.8 6.06,59.01 7.85,60.8 7.85,64.9 9.15,66.5 9.15,72 14.75,77.5 15.95,77.5 17.85,79.3 21.95,79.3 22.55,79.9 29.45,79.9 30.05,80.5 30.05,82.85 X7.7
IN2
  Top 0.305: JP4.9 6.5,61.55 6.65,61.7 6.65,64.5 8.45,66.9 8.45,72.3 14.45,78.2 15.65,78.2 17.45,80 21.75,80 22.35,80.6 27.15,80.6 27.55,81 27.55,82.81 X7.6
INT-DISPLAY  (via drill 0.6)
  Top 0.254: 79.05,15.8 81.05,15.8 81.55,15.1 81.55,13 82.05,12.5 82.55,12.5 82.85,12.2 82.85,10.9 v83.45,10.1
  Top 0.305: X1.1 122.3,27.6 121.35,27.6 120.33,28.62 R15E7.2 120.23,29.6 v119.15,29.9 | JP1.5 79.05,15.8 | v113.15,13.2 113.15,13.3 113.55,13.9 113.55,16.9 113.95,18.3 113.95,21.9 v116.75,24
  Bottom 0.305: v83.45,10.1 84.25,9.3 87.65,9.3 88.35,9 94.85,9 95.65,8.3 95.65,5.3 96.65,4.5 110.15,4.5 112.05,6.4 112.05,7.8 113.25,9.5 113.25,12.9 v113.15,13.2 | v116.75,24 116.75,27.9 117.45,28.5 118.85,29.5 v119.15,29.9
INT-MCP23017  (via drill 0.6)
  Top 0.305: v99.65,12.5 99.15,13 U4.29
  Bottom 0.305: JP1.7 75.65,16.1 76.35,15.5 76.45,15.3 76.45,13.6 76.95,13.2 83.15,13.2 85.15,11.7 94.35,11.7 95.15,10.6 97.85,10.6 v99.65,12.5
INT-RTC  (via drill 0.6)
  Top 0.305: JP1.2 v82.62,14.63 | v77.65,19.3 77.75,19.6 78.75,20.4 78.75,21.7 78.15,22.3 76.65,22.3 75.95,23 75.95,25.6 75.45,26.3 75.45,29.8 73.15,32.1 55.25,50.2 49.75,50.2 v49.45,50.5
  Bottom 0.305: v82.62,14.63 81.35,15.9 77.05,15.9 76.45,16.4 76.45,18.3 v77.65,19.3 | v49.45,50.5 43.45,50.5 43.05,50.9 43.05,53.41 SV1.3
INT-TIME  (via drill 0.6)
  Top 0.305: U$1.!INT/!!SQW 44.95,28.07 44.95,29.3 44.25,30.1 v43.85,30.2 43.15,30.5 41.35,30.5 40.9,30.95 R18.1
  Bottom 0.305: JP2.3 44,35.25 42.75,33.6 42.75,31.4 v43.85,30.2
IRQ1_ADE  (via drill 0.6)
  Top 0.254: 106.25,45.4 101.35,45.4 100.85,45.9 100.85,47.6 101.75,48.7 101.75,48.91 ADE9000.32
  Top 0.305: ADUM6402-2.11 118.25,42.84 118.25,44.4 117.75,44.9 v117.75,45.1 | 107.25,45.2 v107.05,45.1 106.25,45.4
  Bottom 0.305: v117.75,45.1 116.55,43.9 115.25,43.9 113.65,45.5 107.65,45.5 v107.05,45.1
MDC  (via drill 0.6)
  Top 0.254: 28.55,70.4 29.15,71 35.55,71 39.05,67.5 | 55.35,55.1 55.35,54.3 57.45,52.2 58.85,52.2 | 81.05,30.1 v82.45,29.1 | U4.37 95.85,2.9 94.75,3.9 87.75,3.9 86.45,4.8 86.45,6.3 85.45,9.4 85.45,15.1 v86.05,15.5